# Altium schematic sheet TSAL.SchDoc
size Letter; SheetNumber: 4; SheetTotal: 4
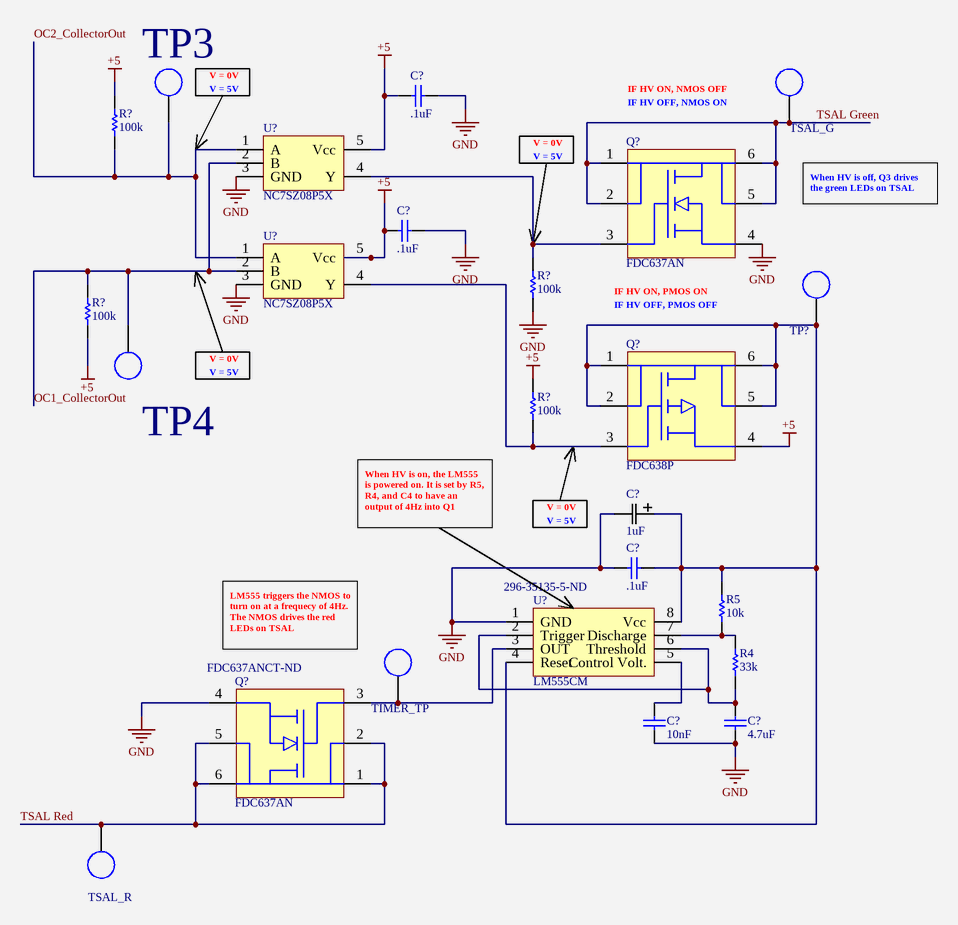
[diagram p0: TSAL.SchDoc]

## Parts
(Parts that share a designator on the sheet are numbered #1, #2 ... from top to bottom, then left to right.)
C?#1  .1uF  [CAPC2013X145X50LL20T25]
C?#2  .1uF  [CAPC2013X145X50LL20T25]
C?#3  1uF  [CAP_J-V_4X5P5_RUB-L]
C?#4  .1uF  [CAPC2013X145X50LL20T25]
C?#5  10nF  [CAPC2013X145X50LL20T25]
C?#6  4.7uF  [CAPC2013X145X50LL20T25]
Q?#1  FDC637AN  [SSOT6]
Q?#2  FDC638P  [SSOT6]
Q?#3  FDC637AN  Supplier Part Number 1: FDC637ANCT-ND  [SSOT6]
R4  33k  [RESC2013X50X30LL20T20]
R5  10k  [RESC2013X50X30LL20T20]
R?#1  100k  [RESC2013X50X30LL20T20]
R?#2  100k  [RESC2013X50X30LL20T20]
R?#3  100k  [RESC2013X50X30LL20T20]
R?#4  100k  [RESC2013X50X30LL20T20]
TIMER_TP  N/A  [PCB Test Point]  (value not drawn)
TP3  N/A  [PCB Test Point]  (value not drawn)
TP4  N/A  [PCB Test Point]  (value not drawn)
TP?  N/A  [PCB Test Point]  (value not drawn)
TSAL_G  N/A  [PCB Test Point]  (value not drawn)
TSAL_R  N/A  [PCB Test Point]  (value not drawn)
U?#1  NC7SZ08P5X  [SOT23-5]
U?#2  NC7SZ08P5X  [SOT23-5]
U?#3  LM555CM  Supplier Part Number 1: 296-35135-5-ND  [SOIC-8]

## Nets
+5: C?#1.2 C?#2.2 Q?#2.4 R?#1.1 R?#3.1 R?#4.1 U?#1.5(Vcc) U?#2.5(Vcc)
GND: C?#1.1 C?#2.1 C?#3.2 C?#4.2 C?#5.2 C?#6.2 Q?#1.4 Q?#3.4 R?#2.2 U?#1.3(GND) U?#2.3(GND) U?#3.1(GND)
OC1_CollectorOut: R?#3.2 TP4.1 U?#1.2(B) U?#2.2(B)
OC2_CollectorOut: R?#1.2 TP3.1 U?#1.1(A) U?#2.1(A)
TSAL Green: Q?#1.1 Q?#1.2 Q?#1.5 Q?#1.6 TSAL_G.1
TSAL Red: Q?#3.1 Q?#3.2 Q?#3.5 Q?#3.6 TSAL_R.1
NetC?#3_1: C?#3.1 C?#4.1 Q?#2.1 Q?#2.2 Q?#2.5 Q?#2.6 R5.1 TP?.1 U?#3.4(Reset) U?#3.8(Vcc)
NetC?#5_1: C?#5.1 U?#3.5(Control_Volt.)
NetC?#6_1: C?#6.1 R4.2 U?#3.2(Trigger) U?#3.6(Threshold)
NetQ?#1_3: Q?#1.3 R?#2.1 U?#1.4(Y)
NetQ?#2_3: Q?#2.3 R?#4.2 U?#2.4(Y)
NetQ?#3_3: Q?#3.3 TIMER_TP.1 U?#3.3(OUT)
NetR4_1: R4.1 R5.2 U?#3.7(Discharge)

## Notes on the sheet
- (near TP3) V = 0V
- V = 5V
- IF HV ON, NMOS OFF
- IF HV OFF, NMOS ON
- V = 0V
- When HV is off, Q3 drives the green LEDs on TSAL
- (near Q?#1) IF HV ON, PMOS ON
- IF HV OFF, PMOS OFF
- (near C?#3) V = 0V
- When HV is on, the LM555 is powered on. It is set by R5, R4, and C4 to have an output of 4Hz into Q1
- (near C?#3) V = 5V
- LM555 triggers the NMOS to turn on at a frequecy of 4Hz. The NMOS drives the red LEDs on TSAL
- Revision
- Title
- Date
- Author
- Project

## Library data of the parts
C?#1 C?#2 C?#4 = CMP-1036-04746-2: Generic SMD Cap, 0805 Package; Manufacturer: Kemet; Part Number: C0805C105K4PACTU; Manufacturer 1: Kyocera AVX; Manufacturer Part Number 1: 08055C104KAT4A; Dielectric Material: Ceramic; Voltage Rating (DC): 50V; Value: 100nF; Tolerance: 10%; Dielectric: X7R; Dissipation Factor: 2.5%; Supplier 1: Digi-Key; Supplier Part Number 1: 478-10836-1-ND; RoHS: Yes; Category: Ceramic Capacitors; Stock 1: 791232; Pricing 1: 1=0.10000, 10=0.06700, 50=0.03640, 100=0.02970, 500=0.02120, 1000=0.01666, 2500=0.01515, 5000=0.01394 (USD); Mounting Technology: Surface Mount; Case/Package: 0805; Pins: 2; Case Code (Imperial): 0805; Case Code (Metric): 2012; Min Operating Temperature: -55°C; Max Operating Temperature: 125°C; Packaging: Tape and Reel; Voltage Rating: 50V; Package Quantity: 15000; Termination: SMD/SMT; Voltage: 50V; Construction: Flat; Length: 2.01mm; Width: 1.25mm; Height: 0.94mm; Depth: 1.25mm; Radiation Hardening: No; Reach SVHC Compliant: Yes; Lead Free: Lead Free; RoHS Compliant: Yes; ComponentLink1URL: https://datasheet.ciiva.com/2988/cx7r-2988015.pdf?src-supplier=Avnet; ComponentLink1Description: https://datasheet.ciiva.com/2988/cx7r-2988015.pdf?src-supplier=Avnet; ComponentLink2URL: https://datasheet.ciiva.com/2988/cx7r-2988016.pdf?src-supplier=Avnet; ComponentLink2Description: https://datasheet.ciiva.com/2988/cx7r-2988016.pdf?src-supplier=Avnet; ComponentLink3URL: https://datasheet.ciiva.com/5423/cx7r-218113-5423437.pdf?src-supplier=Mouser; ComponentLink3Description: https://datasheet.ciiva.com/5423/cx7r-218113-5423437.pdf?src-supplier=Mouser; ComponentLink4URL: https://datasheet.ciiva.com/16222/cx7r-16222253.pdf?src-supplier=Future+Electronics; ComponentLink4Description: https://datasheet.ciiva.com/16222/cx7r-16222253.pdf?src-supplier=Future+Electronics; ComponentLink5URL: https://datasheet.ciiva.com/22676/1679506-22676605.pdf?src-supplier=Element14; ComponentLink5Description: https://datasheet.ciiva.com/22676/1679506-22676605.pdf?src-supplier=Element14; ComponentLink6URL: https://datasheet.ciiva.com/28613/1679506-28613114.pdf?src-supplier=Element14; ComponentLink6Description: https://datasheet.ciiva.com/28613/1679506-28613114.pdf?src-supplier=Element14
C?#3 = 35SZV1M4X5.5: CAP ALUM 1UF 20% 50V SMD; Mfr_Name: Rubycon; Manufacturer Part Number 1: 50SEV1M4X5.5; Ripple Current: 8.4mA; Polarity: Polar; Life (Hours): 2000Hour; Q Factor: 0.12; Supplier 1: Digi-Key; Supplier Part Number 1: 1189-2464-1-ND; Manufacturer 1: Rubycon; RoHS: Yes; Category: Aluminum Electrolytic Capacitors; Stock 1: 6420; Pricing 1: 1=0.53000, 10=0.36700, 50=0.25680, 100=0.22010, 500=0.16508, 1000=0.13940 (USD); Mounting Technology: Surface Mount; Case/Package: Radial; Min Operating Temperature: -40°C; Max Operating Temperature: 85°C; Voltage Rating: 50V; Value: 1uF; Tolerance: 20%; Packaging: Tape and Reel; Package Quantity: 1; Voltage: 50V; Series: SEV; Construction: Cylindrical; Height - Seated (Max): 0.217inch; Radiation Hardening: No; Lead Free: Lead Free; RoHS Compliant: Yes; ComponentLink1URL: https://datasheet.ciiva.com/14116/sasev-data-e-14116112.pdf?src-supplier=Distrelec; ComponentLink1Description: https://datasheet.ciiva.com/14116/sasev-data-e-14116112.pdf?src-supplier=Distrelec; ComponentLink2URL: https://datasheet.ciiva.com/41805/sev-series-41805573.pdf?src-supplier=Digi-Key; ComponentLink2Description: https://datasheet.ciiva.com/41805/sev-series-41805573.pdf?src-supplier=Digi-Key
C?#5 = CMP-1036-04746-2: Generic SMD Cap, 0805 Package; Manufacturer 1: KEMET; Manufacturer Part Number 1: C0805C103F5GEC7800; Supplier 1: Digi-Key; Supplier Part Number 1: 399-C0805C103F5GEC7800CT-ND; RoHS: No; Category: Ceramic Capacitors; Stock 1: 7870; Pricing 1: 1=1.29000, 10=1.01700, 50=0.88180, 100=0.76310, 500=0.57656, 1000=0.50874 (USD)
C?#6 = CMP-1036-04746-2: Generic SMD Cap, 0805 Package; Manufacturer 1: TDK; Manufacturer Part Number 1: C2012X5R1E475K125AB; Dielectric Material: Ceramic; Voltage Rating: 25V; Tolerance: 10%; Dielectric: X5R; Supplier 1: Digi-Key; Supplier Part Number 1: 445-4116-1-ND; RoHS: Yes; Category: Ceramic Capacitors; Stock 1: 2458030; Pricing 1: 1=0.27000, 10=0.18200, 50=0.12120, 100=0.10300, 500=0.07272, 1000=0.06363 (USD); Mounting Technology: Surface Mount; Case/Package: 0805; Pins: 2; Case Code (Imperial): 0805; Case Code (Metric): 2012; Weight: 0.000194oz; Min Operating Temperature: -55°C; Max Operating Temperature: 85°C; Value: 4.7uF; Voltage Rating (DC): 25V; Packaging: Tape and Reel; Package Quantity: 2000; Termination: SMD/SMT; Resistor Type: Ceramic; Voltage: 25V; Series: C; Construction: Flat; Length: 2mm; Width: 1.25mm; Height: 1.25mm; Thickness: 0.057inch; Depth: 1.25mm; Radiation Hardening: No; Reach SVHC Compliant: Yes; Lead Free: Lead Free; RoHS Compliant: Yes; ComponentLink1URL: https://datasheet.ciiva.com/24216/tdkmlcccaprange-24216480.pdf?src-supplier=Mouser; ComponentLink1Description: https://datasheet.ciiva.com/24216/tdkmlcccaprange-24216480.pdf?src-supplier=Mouser; ComponentLink2URL: https://datasheet.ciiva.com/36857/1796654-36857301.pdf?src-supplier=Element14; ComponentLink2Description: https://datasheet.ciiva.com/36857/1796654-36857301.pdf?src-supplier=Element14; ComponentLink3URL: https://datasheet.ciiva.com/28602/1744655-28602173.pdf?src-supplier=Element14; ComponentLink3Description: https://datasheet.ciiva.com/28602/1744655-28602173.pdf?src-supplier=Element14; ComponentLink4URL: https://datasheet.ciiva.com/6251/tdkmlcccaprange-6251820.pdf?src-supplier=Digi-Key; ComponentLink4Description: https://datasheet.ciiva.com/6251/tdkmlcccaprange-6251820.pdf?src-supplier=Digi-Key; ComponentLink5URL: https://datasheet.ciiva.com/6251/tdkmlcccaprange-6251817.pdf?src-supplier=Digi-Key; ComponentLink5Description: https://datasheet.ciiva.com/6251/tdkmlcccaprange-6251817.pdf?src-supplier=Digi-Key; ComponentLink6URL: https://datasheet.ciiva.com/6251/tdkmlcccaprange-6251823.pdf?src-supplier=Digi-Key; ComponentLink6Description: https://datasheet.ciiva.com/6251/tdkmlcccaprange-6251823.pdf?src-supplier=Digi-Key; ComponentLink7URL: https://datasheet.ciiva.com/16449/e412-c-16449599.pdf?src-supplier=Future+Electronics; ComponentLink7Description: https://datasheet.ciiva.com/16449/e412-c-16449599.pdf?src-supplier=Future+Electronics
Q?#1 Q?#3 = FDC637AN: N Channel FET, SMT, 6.2A, 20V; Manufacturer: On Semi; TargetLibrary: RITRacing-Transistors; PartNumber: FDC637AN; Publisher: T.Tallo; Published: 09/27/2017; Status: Active; ComponentLink1Description: Datasheet; ComponentLink1URL: https://www.mouser.com/datasheet/2/308/FDS4465-1297512.pdf; Supplier 1: Digi-Key
  Q?#1: Supplier Part Number 1: FDC637ANCT-ND
Q?#2 = FDC638P: P Channel FET, SMT, 4.5A, 20V; Manufacturer: On Semi; TargetLibrary: RITRacing-Transistors; PartNumber: FDC638P; Publisher: T.Tallo; Published: 09/27/2017; Status: Active; ComponentLink1Description: Datasheet; ComponentLink1URL: https://www.mouser.com/datasheet/2/308/FDS4465-1297512.pdf; Supplier 1: Digi-Key; Supplier Part Number 1: FDC638PCT-ND
R4 = CMP-2001-04896-1: Manufacturer: Vishay Dale; Part Number: CRCW08050000Z0EA; Manufacturer 1: Panasonic; Manufacturer Part Number 1: ERA-6AEB333V; Value: 33kR; Power Rating: 125mW; Tolerance: 0.1%; Temperature Coefficient: 25ppm/°C; Voltage Rating: 100V; Supplier 1: Digi-Key; Supplier Part Number 1: P33KDACT-ND; RoHS: Yes; Category: Chip SMD Resistors; Stock 1: 160000; Pricing 1: 1=0.36000, 10=0.30100, 100=0.11770, 500=0.07116, 1000=0.04927, 2500=0.04516 (USD); Mounting Technology: Surface Mount; Case/Package: 0805; Pins: 2; Case Code (Metric): 2012; Case Code (Imperial): 0805; Contact Plating: Tin; Min Operating Temperature: -55°C; Max Operating Temperature: 155°C; Packaging: Tape and Reel; Resistor Type: Thin Film; Termination: SMD/SMT; Series: ERA-6A; Voltage Rating (DC): 100V; Package Quantity: 1; Number of Terminations: 2; Max Power Dissipation: 125mW; Resistance Tolerance: 0.1%; Features: Automotive AEC-Q200; Construction: Rectangular; Technology: METAL FILM; Length: 2mm; Width: 1.25mm; Height: 0.5mm; Depth: 1.25mm; Ratings: AEC-Q200; Radiation Hardening: No; RoHS Compliant: Yes; Lead Free: Lead Free; Military Standard: Not; Reach SVHC Compliant: Yes; ComponentLink1URL: https://datasheet.ciiva.com/11813/0900766b80beefcc-11813136.pdf?src-supplier=Rs; ComponentLink1Description: https://datasheet.ciiva.com/11813/0900766b80beefcc-11813136.pdf?src-supplier=Rs; ComponentLink2URL: https://datasheet.ciiva.com/26335/453496-da-01-en-widerstand-0805-era-26335713.pdf?src-supplier=Conrad; ComponentLink2Description: https://datasheet.ciiva.com/26335/453496-da-01-en-widerstand-0805-era-26335713.pdf?src-supplier=Conrad; ComponentLink3URL: https://datasheet.ciiva.com/43455/485442-43455275.pdf?src-supplier=Farnell; ComponentLink3Description: https://datasheet.ciiva.com/43455/485442-43455275.pdf?src-supplier=Farnell; ComponentLink4URL: https://datasheet.ciiva.com/46397/485442-46397061.pdf?src-supplier=Element14; ComponentLink4Description: https://datasheet.ciiva.com/46397/485442-46397061.pdf?src-supplier=Element14; ComponentLink5URL: https://datasheet.ciiva.com/48530/era-eng-tds-48530172.pdf?src-supplier=Distrelec; ComponentLink5Description: https://datasheet.ciiva.com/48530/era-eng-tds-48530172.pdf?src-supplier=Distrelec; ComponentLink6URL: https://datasheet.ciiva.com/43457/485442-43457817.pdf?src-supplier=Farnell; ComponentLink6Description: https://datasheet.ciiva.com/43457/485442-43457817.pdf?src-supplier=Farnell; ComponentLink7URL: https://datasheet.ciiva.com/46436/485442-46436607.pdf?src-supplier=Element14; ComponentLink7Description: https://datasheet.ciiva.com/46436/485442-46436607.pdf?src-supplier=Element14; ComponentLink8URL: https://datasheet.ciiva.com/24068/aoa0000ce26-197354-24068904.pdf?src-supplier=Mouser; ComponentLink8Description: https://datasheet.ciiva.com/24068/aoa0000ce26-197354-24068904.pdf?src-supplier=Mouser; ComponentLink9URL: https://datasheet.ciiva.com/9190/aoa0000ce26-9190636.pdf?src-supplier=Avnet; ComponentLink9Description: https://datasheet.ciiva.com/9190/aoa0000ce26-9190636.pdf?src-supplier=Avnet; ComponentLink10URL: https://datasheet.ciiva.com/30187/54aoa0000ce26-30187628.pdf?src-supplier=Onlinecomponents.com; ComponentLink10Description: https://datasheet.ciiva.com/30187/54aoa0000ce26-30187628.pdf?src-supplier=Onlinecomponents.com
R5 = CMP-2001-04896-1: Manufacturer: Vishay Dale; Part Number: CRCW08050000Z0EA; Manufacturer 1: Panasonic; Manufacturer Part Number 1: ERJ-6GEYJ103V; Value: 10kR; Tolerance: 5%; Power Rating: 125mW; Voltage Rating: 150V; Temperature Coefficient: 200ppm/°C; Supplier 1: Digi-Key; Supplier Part Number 1: P10KACT-ND; RoHS: Yes; Category: Chip SMD Resistors; Stock 1: 2932917; Pricing 1: 1=0.10000, 10=0.06800, 100=0.02780, 1000=0.01251, 2500=0.01086 (USD); Mounting Technology: Surface Mount; Case/Package: 0805; Case Code (Metric): 2012; Case Code (Imperial): 0805; Contact Plating: Tin; Min Operating Temperature: -55°C; Max Operating Temperature: 155°C; Packaging: Tape and Reel; Resistor Type: Thick Film; Number of Terminations: 2; Termination: SMD/SMT; Max Power Dissipation: 125mW; Series: ERJ; Resistance Tolerance: 5%; Voltage Rating (DC): 150V; Package Quantity: 5000; Technology: THICK FILM; Construction: Rectangular; Features: Automotive AEC-Q200; Length: 2mm; Width: 1.25mm; Height: 0.6mm; Depth: 1.25mm; Radiation Hardening: No; RoHS Compliant: Yes; Military Standard: Not; Lead Free: Lead Free; Reach SVHC Compliant: Yes; ComponentLink1URL: https://datasheet.ciiva.com/11821/0900766b80f806dd-11821504.pdf?src-supplier=Rs; ComponentLink1Description: https://datasheet.ciiva.com/11821/0900766b80f806dd-11821504.pdf?src-supplier=Rs; ComponentLink2URL: https://datasheet.ciiva.com/16782/70255313-16782712.pdf?src-supplier=Allied+Electronics; ComponentLink2Description: https://datasheet.ciiva.com/16782/70255313-16782712.pdf?src-supplier=Allied+Electronics; ComponentLink3URL: https://datasheet.ciiva.com/9117/aoa0000ce1-9117371.pdf?src-supplier=Avnet; ComponentLink3Description: https://datasheet.ciiva.com/9117/aoa0000ce1-9117371.pdf?src-supplier=Avnet; ComponentLink4URL: https://datasheet.ciiva.com/16428/aoa0000ce1-16428072.pdf?src-supplier=Future+Electronics; ComponentLink4Description: https://datasheet.ciiva.com/16428/aoa0000ce1-16428072.pdf?src-supplier=Future+Electronics; ComponentLink5URL: https://datasheet.ciiva.com/30128/4aoa0000ce1-30128839.pdf?src-supplier=Onlinecomponents.com; ComponentLink5Description: https://datasheet.ciiva.com/30128/4aoa0000ce1-30128839.pdf?src-supplier=Onlinecomponents.com; ComponentLink6URL: https://datasheet.ciiva.com/43460/1500035-43460125.pdf?src-supplier=Farnell; ComponentLink6Description: https://datasheet.ciiva.com/43460/1500035-43460125.pdf?src-supplier=Farnell; ComponentLink7URL: https://datasheet.ciiva.com/46386/1500035-46386469.pdf?src-supplier=Element14; ComponentLink7Description: https://datasheet.ciiva.com/46386/1500035-46386469.pdf?src-supplier=Element14; ComponentLink8URL: https://datasheet.ciiva.com/22785/1500035-22785957.pdf?src-supplier=Farnell; ComponentLink8Description: https://datasheet.ciiva.com/22785/1500035-22785957.pdf?src-supplier=Farnell; ComponentLink9URL: https://datasheet.ciiva.com/28514/1678796-28514236.pdf?src-supplier=Element14; ComponentLink9Description: https://datasheet.ciiva.com/28514/1678796-28514236.pdf?src-supplier=Element14; ComponentLink10URL: https://datasheet.ciiva.com/16787/70255313-16787775.pdf?src-supplier=Allied+Electronics; ComponentLink10Description: https://datasheet.ciiva.com/16787/70255313-16787775.pdf?src-supplier=Allied+Electronics
R?#1-R?#4 = CMP-2001-04896-1: Manufacturer: Vishay Dale; Part Number: CRCW08050000Z0EA
TIMER_TP TP3 TP4 TP? TSAL_G TSAL_R = PCB Test Point: Manufacturer: RIT Racing; TargetLibrary: RITRacing-Connectors; PartNumber: N/A; Publisher: T.Tallo; Published: 22Oct2016; Status: Active; ComponentLink1URL: http://www.mouser.com/ds/2/215/005-5009-743680.pdf; ComponentLink1Description: Datasheet
U?#1 U?#2 = NC7SZ08P5X: Single, 2 Input AND Gate, SMD; Manufacturer: ON Semi; TargetLibrary: RITRacing-ICs; PartNumber: NC7SZ08P5X; Publisher: T.Tallo; Published: 20Oct2016; Status: Active; ComponentLink1URL: http://www.ti.com/lit/ds/symlink/cd4081b.pdf; ComponentLink1Description: Datasheet; Supplier 1: Digi-Key; Supplier Part Number 1: NC7SZ08P5XCT-ND
U?#3 = LM555CM: 555 Timer; Manufacturer: Texas Instruments; TargetLibrary: RITRacing-ICs; PartNumber: LM555CM; Publisher: T.Tallo; Published: 27Oct2016; Status: Active; ComponentLink1URL: http://www.ti.com/lit/ds/symlink/lm393-n.pdf; ComponentLink1Description: Datasheet; Supplier 1: Digi-Key